# Altium project TVP5150AM1.PrjPcb
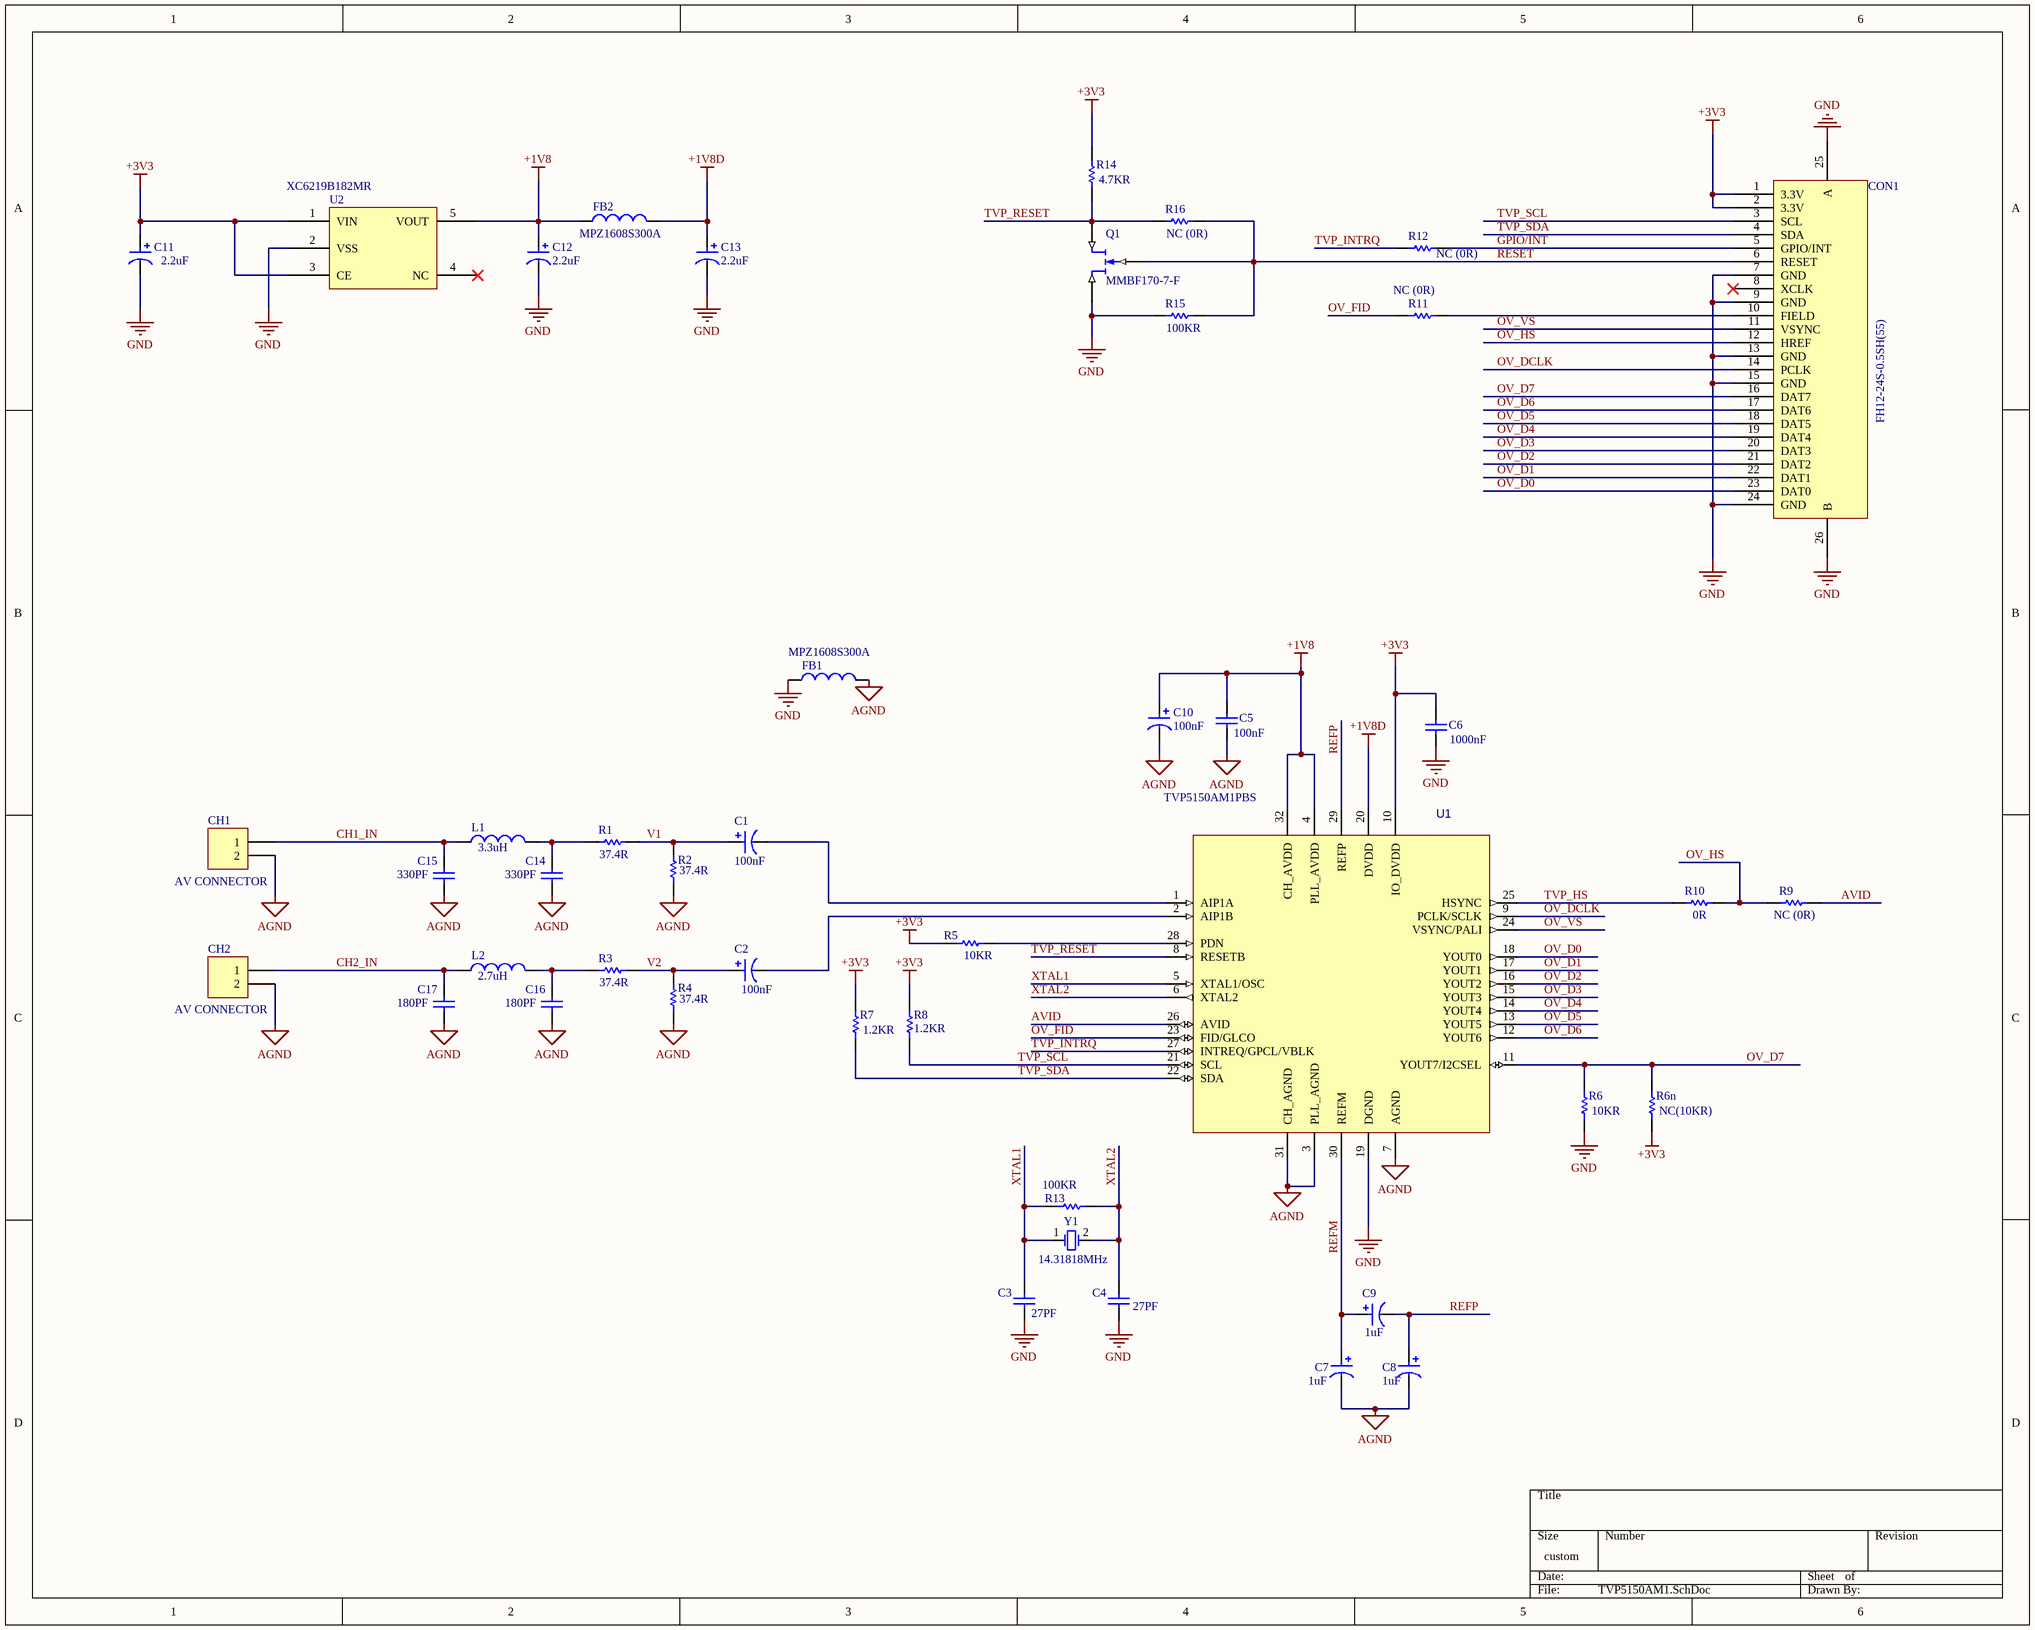
[diagram p0: TVP5150AM1.SchDoc]
1 sheet, 45 parts. Net scope: global (net labels, ports and power ports of the same name join across sheets).
Board file: TVP5150AM1.PcbDoc

## Sheet TVP5150AM1.SchDoc
size 381 x 304 mm

### Parts
C1  100nF  [C_1206 (3216 Metric)]
C2  100nF  [C_1206 (3216 Metric)]
C3  27PF  [C_0805 (2012 Metric)]
C4  27PF  [C_0805 (2012 Metric)]
C5  100nF  [C_0805 (2012 Metric)]
C6  1000nF  [C_0805 (2012 Metric)]
C7  1uF  [C_1206 (3216 Metric)]
C8  1uF  [C_1206 (3216 Metric)]
C9  1uF  [C_1206 (3216 Metric)]
C10  100nF  [C_1206 (3216 Metric)]
C11  2.2uF  [Tantalum-A]
C12  2.2uF  [Tantalum-A]
C13  2.2uF  [Tantalum-A]
C14  330PF  [C_0805 (2012 Metric)]
C15  330PF  [C_0805 (2012 Metric)]
C16  180PF  [C_0805 (2012 Metric)]
C17  180PF  [C_0805 (2012 Metric)]
CH1  AV CONNECTOR  [RCA-CONN]
CH2  AV CONNECTOR  [RCA-CONN]
CON1  PartNumber: FH12-24S-0.5SH(55)  [FH12-24S-0.5SH]  (hidden comment: 24 PIN FFC CONNECTOR 0.5MM PITCH)
FB1  MPZ1608S300A  [L_0805 (2012 Metric)]
FB2  MPZ1608S300A  [L_0805 (2012 Metric)]
L1  3.3uH  [L_0805 (2012 Metric)]
L2  2.7uH  [L_0805 (2012 Metric)]
Q1  MMBF170-7-F  [SOT-23-3]
R1  37.4R  [R_0805 (2012 Metric)]
R2  37.4R  [R_0805 (2012 Metric)]
R3  37.4R  [R_0805 (2012 Metric)]
R4  37.4R  [R_0805 (2012 Metric)]
R5  10KR  [R_0805 (2012 Metric)]
R6  10KR  [R_0805 (2012 Metric)]
R6n  NC(10KR)  [R_0805 (2012 Metric)]
R7  1.2KR  [R_0805 (2012 Metric)]
R8  1.2KR  [R_0805 (2012 Metric)]
R9  NC (0R)  [R_0805 (2012 Metric)]
R10  0R  [R_0805 (2012 Metric)]
R11  NC (0R)  [R_0805 (2012 Metric)]
R12  NC (0R)  [R_0805 (2012 Metric)]
R13  100KR  [R_0805 (2012 Metric)]
R14  4.7KR  [R_0805 (2012 Metric)]
R15  100KR  [R_0805 (2012 Metric)]
R16  NC (0R)  [R_0805 (2012 Metric)]
U1  TVP5150AM1PBS  [PBS32]
U2  XC6219B182MR  [SOT23-5]
Y1  14.31818MHz  [XTAL_S]

### Nets
+1V8: C5.1 C10.1 C12.1 FB2.1 U1.4(PLL_AVDD) U1.32(CH_AVDD) U2.5(VOUT)
+1V8D: C13.1 FB2.2 U1.20(DVDD)
+3V3: C6.1 C11.1 CON1.1(3.3V) CON1.2(3.3V) R5.2 R6n.2 R7.1 R8.1 R14.1 U1.10(IO_DVDD) U2.1(VIN) U2.3(CE)
AGND: C5.2 C7.2 C8.2 C10.2 C14.1 C15.1 C16.1 C17.1 CH1.2 CH2.2 FB1.2 R2.2 R4.2 U1.3(PLL_AGND) U1.7(AGND) U1.31(CH_AGND)
GND: C3.1 C4.1 C6.2 C11.2 C12.2 C13.2 CON1.7(GND) CON1.9(GND) CON1.13(GND) CON1.15(GND) CON1.24(GND) CON1.25(A) CON1.26(B) FB1.1 Q1.2(S) R6.2 R15.1 U1.19(DGND) U2.2(VSS)
AVID: R9.2 U1.26(AVID)
CH1_IN: C15.2 CH1.1 L1.1
CH2_IN: C17.2 CH2.1 L2.1
GPIO/INT: CON1.5(GPIO/INT) R12.2
OV_D0: CON1.23(DAT0) U1.18(YOUT0)
OV_D1: CON1.22(DAT1) U1.17(YOUT1)
OV_D2: CON1.21(DAT2) U1.16(YOUT2)
OV_D3: CON1.20(DAT3) U1.15(YOUT3)
OV_D4: CON1.19(DAT4) U1.14(YOUT4)
OV_D5: CON1.18(DAT5) U1.13(YOUT5)
OV_D6: CON1.17(DAT6) U1.12(YOUT6)
OV_D7: CON1.16(DAT7) R6.1 R6n.1 U1.11(YOUT7/I2CSEL)
OV_DCLK: CON1.14(PCLK) U1.9(PCLK/SCLK)
OV_FID: R11.1 U1.23(FID/GLCO)
OV_HS: CON1.12(HREF) R9.1 R10.2
OV_VS: CON1.11(VSYNC) U1.24(VSYNC/PALI)
REFM: C7.1 C9.1 U1.30(REFM)
REFP: C8.1 C9.2 U1.29(REFP)
RESET: CON1.6(RESET) Q1.1(G) R15.2 R16.2
TVP_HS: R10.1 U1.25(HSYNC)
TVP_INTRQ: R12.1 U1.27(INTREQ/GPCL/VBLK)
TVP_RESET: Q1.3(D) R14.2 R16.1 U1.8(RESETB)
TVP_SCL: CON1.3(SCL) R8.2 U1.21(SCL)
TVP_SDA: CON1.4(SDA) R7.2 U1.22(SDA)
V1: C1.1 R1.2 R2.1
V2: C2.1 R3.2 R4.1
XTAL1: C3.2 R13.2 U1.5(XTAL1/OSC) Y1.1(OSC1)
XTAL2: C4.2 R13.1 U1.6(XTAL2) Y1.2(OSC2)
NetC1_2: C1.2 U1.1(AIP1A)
NetC2_2: C2.2 U1.2(AIP1B)
NetC14_2: C14.2 L1.2 R1.1
NetC16_2: C16.2 L2.2 R3.1
NetCON1_10: CON1.10(FIELD) R11.2
NetR5_1: R5.1 U1.28(PDN)

Not connected (* = marked no-connect by the designer): CON1 8(XCLK)*; U2 4(NC)*

### Library data of the parts
C1 C2 C7-C10 = Cap Pol SMD: Chip Monolithic Ceramic Capacitor; SMD; Manufacturer: Vishay or AVX Corporation; Current Footprint: 1206 (3216 Metric); Assembly Status: A; Published: 8-Jun-2000; LatestRevisionDate: 17-Jul-2002; LatestRevisionNote: Re-released for DXP Platform.; PackageReference: RB7.6-15; Publisher: Altium Limited
  C1 C2 C10: Value: 100nF; PartNumber: 100nF; Part Number: 100nF
  C7-C9: Value: 1uF; PartNumber: 1uF; Part Number: 1uF
C3-C6 C14-C17 = Cap: Chip Monolithic Ceramic Capacitor; SMD; Current Footprint: 0805 (2012 Metric); Published: 8-Jun-2000; LatestRevisionDate: 17-Jul-2002; LatestRevisionNote: Re-released for DXP Platform.; PackageReference: RAD-0.3; Publisher: Altium Limited
  C3 C4: Value: 27PF; PartNumber: 27PF; Part Number: 27PF
  C5: Value: 100nF; PartNumber: 100nF; Part Number: 100nF
  C6: Value: 1000nF; PartNumber: 1000nF; Part Number: 1000nF
  C14 C15: Value: 330PF; PartNumber: 330PF; Part Number: 330PF
  C16 C17: Value: 180PF; PartNumber: 180PF; Part Number: 180PF
C11-C13 = Cap Pol SMD: Tantalum SMD Capacitor; Manufacturer: Vishay or AVX Corporation; Assembly Status: A; Published: 8-Jun-2000; LatestRevisionDate: 17-Jul-2002; LatestRevisionNote: Re-released for DXP Platform.; PackageReference: RB7.6-15; Publisher: Altium Limited; Current Footprint: Tantalum-A; Value: 2.2uF; PartNumber: 2.2uF; Part Number: 2.2uF
CH1 CH2 = Header 2: Header, 2-Pin; LatestRevisionDate: 17-Jul-2002; LatestRevisionNote: Re-released for DXP Platform.; Publisher: Altium Limited; PartNumber: AV CONNECTOR; Part Number: AV CONNECTOR; Current Footprint: RCA-CONN
CON1 = CSI DVP CAMERA CONNECTOR: CONN FFC BOTTOM 24POS 0.50MM R/A; Manufacturer: Hirose Electric Co Ltd; Pitch: 0.020" (0.50mm); Current Rating: 0.5A; Flat Flex Type: FFC, FPC; Connector/Contact Type: Contacts, Bottom; Material Flammability Rating: UL94 V-0; Actuator Material: Polyphenylene Sulfide (PPS); Cable End Type: Straight; Voltage Rating: 50V; Number of Positions: 24; Locking Feature: Flip Lock; FFC, FCB Thickness: 0.30mm; Category: Connectors, Interconnects; Housing Material: Polyamide (PA), Nylon; Operating Temperature: -40°C ~ 85°C; Termination: Solder; Part Status: Active; Contact Finish: Gold; Packaging: Cut Tape (CT); Height Above Board: 0.079" (2.00mm); RoHS: RoHS Compliant; Mounting Type: Surface Mount, Right Angle; Contact Material: Phosphor Bronze; Features: Zero Insertion Force (ZIF); Manufacturer Part Number: FH12-24S-0.5SH(55); Supplier: Digi-Key; Pricing: 1=2.26, 10=2.048, 25=1.9228, 50=1.8392, 100=1.7556, 250=1.5884, 500=1.463, 1000=1.254 (USD); Supplier Part Number: HFJ124CT-ND; Part Number: FH12-24S-0.5SH(55); Current Footprint: FH12-24S-0.5SH
FB1 FB2 = Inductor: FERRITE BEAD 30 OHM 0603 1LN; Manufacturer Part Number: MPZ1608S300ATAH0; Code_IEC: 1005; Current Footprint: 0805 (2012 Metric); Assembly Status: A; Filter Type: Power Line; Number of Lines: 1; Impedance @ Frequency: 30 Ohm @ 100MHz; Current Rating (Max): 5A; DC Resistance (DCR) (Max): 10 mOhm; Published: 8-Jun-2000; LatestRevisionDate: 17-Jul-2002; LatestRevisionNote: Re-released for DXP Platform.; PackageReference: 0402-A; Publisher: Altium Limited; Code_JEITA: 0402; Manufacturer: *; Value: MPZ1608S300A; PartNumber: MPZ1608S300A; Supplier 1: Digi-Key; Supplier Part Number 1: 445-1562-2-ND; RoHS: RoHS Compliant; Category: Filters; Stock 1: 76000; Pricing 1: 4000=0.0208, 8000=0.01885, 12000=0.0182, 28000=0.0169, 100000=0.01671 (USD); Packaging: Tape & Reel (TR); Part Status: Active; Ratings: -; Operating Temperature: -55°C ~ 125°C; Package / Case: 0603 (1608 Metric); Mounting Type: Surface Mount; Height (Max): 0.030" (0.75mm); Size / Dimension: 0.063" L x 0.031" W (1.60mm x 0.80mm); ComponentLink1URL: https://product.tdk.com/info/en/catalog/datasheets/beads_commercial_power_mpz1608_en.pdf; ComponentLink1Description: https://product.tdk.com/info/en/catalog/datasheets/beads_commercial_power_mpz1608_en.pdf; Part Number: MPZ1608S300A
L1 = Inductor: FIXED IND 3.3UH 750MA 300 MOHM SMD; Code_IEC: 1005; Current Footprint: 0805 (2012 Metric); Assembly Status: A; Published: 8-Jun-2000; LatestRevisionDate: 17-Jul-2002; LatestRevisionNote: Re-released for DXP Platform.; PackageReference: 0402-A; Publisher: Altium Limited; Code_JEITA: 0402; Manufacturer: *; Value: 3.3uH; PartNumber: 3.3uH; Part Number: 3.3uH
L2 = Inductor: FIXED IND 2.7UH 750MA 300 MOHM SMD; Code_IEC: 1005; Current Footprint: 0805 (2012 Metric); Assembly Status: A; Published: 8-Jun-2000; LatestRevisionDate: 17-Jul-2002; LatestRevisionNote: Re-released for DXP Platform.; PackageReference: 0402-A; Publisher: Altium Limited; Code_JEITA: 0402; Manufacturer: *; Value: 2.7uH; PartNumber: 2.7uH; Part Number: 2.7uH
Q1 = MESFET-N: MOSFET N-CH 60V 500MA SOT23-3; Manufacturer: Diodes Incorporated; FET Type: N-Channel; Rds On (Max) @ Id, Vgs: 5 Ohm @ 200mA, 10V; Input Capacitance (Ciss) @ Vds: 40pF @ 10V; Power Dissipation (Max): 300mW (Ta); Vgs(th) (Max) @ Id: 3V @ 250µA; Current - Continuous Drain (Id) @ 25°C: 500mA (Ta); Mounting Type: Surface Mount; Manufacturer Part Number: MMBF170-7-F; Gate Charge (Qg) @ Vgs: -; RoHS: RoHS Compliant; Category: Discrete Semiconductor Products; Drain to Source Voltage (Vdss): 60V; Operating Temperature: -55°C ~ 150°C (TJ); FET Feature: -; Supplier: Digi-Key; Part Status: Active; Packaging: Tape & Reel (TR); Technology: MOSFET (Metal Oxide); Supplier Part Number: MMBF170-FDITR-ND; Supplier Device Package: SOT-23-3; Package / Case: TO-236-3, SC-59, SOT-23-3; PartNumber: MMBF170-7-F; Pricing: 3000=0.06325, 6000=0.055, 15000=0.04675, 30000=0.044, 75000=0.04125, 150000=0.03575 (USD); HelpURL: C:\Users\MEHDI-PC\Desktop\Docs\ds30104.pdf; Stock: 30000; Part Number: MMBF170-7-F; Current Footprint: SOT-23-3
R1-R6 R6n R7-R16 = Res1: Resistor; Current Footprint: 0805 (2012 Metric); Published: 8-Jun-2000; LatestRevisionDate: 17-Jul-2002; LatestRevisionNote: Re-released for DXP Platform.; PackageReference: AXIAL-0.3; Publisher: Altium Limited
  R1-R4: Value: 37.4R; PartNumber: 37.4R; Part Number: 37.4R
  R5 R6: Value: 10KR; PartNumber: 10KR; Part Number: 10KR
  R6n: Value: NC(10KR); PartNumber: NC(10KR); Part Number: NC(10KR)
  R7 R8: Value: 1.2KR; PartNumber: 1.2KR; Part Number: 1.2KR
  R9 R11 R12 R16: Value: NC (0R); PartNumber: NC (0R); Part Number: NC (0R)
  R10: Value: 0R; PartNumber: 0R; Part Number: 0R
  R13 R15: Value: 100KR; PartNumber: 100KR; Part Number: 100KR
  R14: Value: 4.7KR; PartNumber: 4.7KR; Part Number: 4.7KR
U1 = TVP5150AM1PBS: Ultralow Power NTSC/PAL/SECAM 9-Bit Video Decoder with Robust Sync Detector, 32-Pin TQFP; Published: 6-Oct-2005; LatestRevisionDate: 13-Apr-2006; LatestRevisionNote: IPC-7351 Footprint Added.; DatasheetVersion: May-2004; PackageVersion: Nov-1995; PackageReference: PBS32; Publisher: Altium Limited; PackageDescription: 32-Pin Thin Plastic Quad Flat Pack 0.5 mm Pitch; Code_JEDEC: MS-026-AAA; ComponentLink1Description: Manufacturer Link; ComponentLink1URL: http://focus.ti.com/docs/prod/folders/print/tvp5150am1.html; ComponentLink2Description: Datasheet; ComponentLink2URL: http://focus.ti.com/lit/ds/symlink/tvp5150am1.pdf; PartNumber: TVP5150AM1PBS; HelpURL: C:\Users\MEHDI-PC\Desktop\Docs\tvp5150am1.pdf; Part Number: TVP5150AM1PBS; Current Footprint: PBS32
U2 = XC6219B182MR: 300mA High Speed LDO Regulators with ON/OFF Switch; PartNumber: XC6219B182MR; HelpURL: C:\Users\MEHDI-PC\Desktop\Docs\Torex-XC6219B182MR-datasheet.pdf; Part Number: XC6219B182MR; Current Footprint: SOT23-5
Y1 = XTAL: CRYSTAL 14.7456MHZ 18PF THRU; Manufacturer: TXC CORPORATION; Assembly Status: A; Published: 8-Jun-2000; LatestRevisionDate: 17-Jul-2002; LatestRevisionNote: Re-released for DXP Platform.; PackageReference: R38; Publisher: Altium Limited; Current Footprint: XTAL_S; Supplier 1: Digi-Key; Supplier Part Number 1: CTX908-ND; PartNumber: 14.31818MHz; Part Number: 14.31818MHz